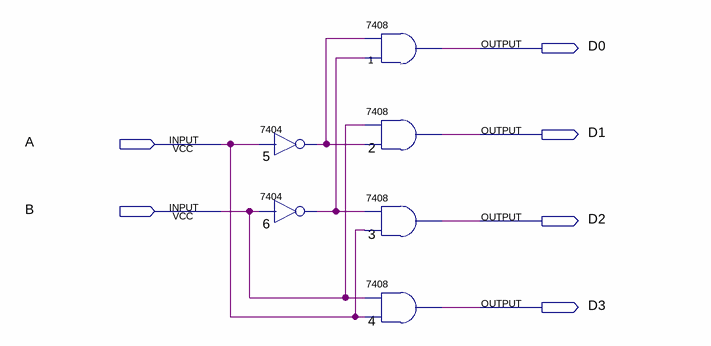
[diagram p0: schematic sheet]
// Quartus schematic 1.bdf as structural Verilog: 6 symbols, 6 pins
module \1  (
  input  A,
  input  B,
  output D0,
  output D1,
  output D2,
  output D3
);

  wire n5_1, n6_1;

  \7404  u_5 (.\2 (A), .\1 (n5_1));
  \7404  u_6 (.\2 (B), .\1 (n6_1));
  \7408  u_1 (.\3 (n6_1), .\2 (n5_1), .\1 (D0));
  \7408  u_2 (.\3 (n5_1), .\2 (B), .\1 (D1));
  \7408  u_3 (.\3 (A), .\2 (n6_1), .\1 (D2));
  \7408  u_4 (.\3 (A), .\2 (B), .\1 (D3));
endmodule
